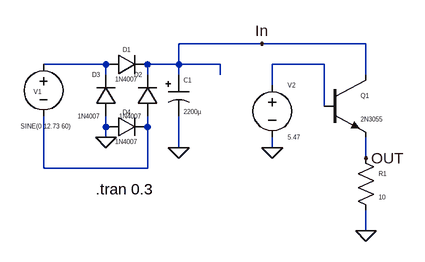
[diagram p0: schematic V1_front_end.asc]
V1_front_end.asc, the LTspice schematic file:
Version 4.1
SHEET 1 880 680
WIRE 384 80 256 80
WIRE 544 80 384 80
WIRE 144 112 48 112
WIRE 256 112 256 80
WIRE 256 112 208 112
WIRE 320 112 256 112
WIRE 480 112 400 112
WIRE 144 128 144 112
WIRE 208 128 208 112
WIRE 256 128 256 112
WIRE 320 128 320 112
WIRE 544 128 544 80
WIRE 400 144 400 112
WIRE 480 176 480 112
WIRE 144 208 144 192
WIRE 208 208 208 192
WIRE 144 224 144 208
WIRE 256 240 256 192
WIRE 400 240 400 224
WIRE 544 256 544 224
WIRE 48 272 48 192
WIRE 208 272 208 208
WIRE 208 272 48 272
WIRE 544 368 544 336
FLAG 144 224 0
FLAG 256 240 0
FLAG 400 240 0
FLAG 544 368 0
FLAG 544 256 OUT
FLAG 384 80 In
SYMBOL voltage 48 96 R0
WINDOW 0 -15 58 Left 0
WINDOW 3 -35 111 Left 0
WINDOW 123 0 0 Left 0
WINDOW 39 0 0 Left 0
SYMATTR InstName V1
SYMATTR Value SINE(0 12.73 60)
SYMBOL diode 144 128 R270
WINDOW 0 32 32 VTop 0
WINDOW 3 0 32 VBottom 0
SYMATTR InstName D1
SYMATTR Value 1N4007
SYMBOL diode 160 192 R180
WINDOW 0 24 64 Left 0
WINDOW 3 24 0 Left 0
SYMATTR InstName D3
SYMATTR Value 1N4007
SYMBOL diode 224 192 R180
WINDOW 0 24 64 Left 0
WINDOW 3 24 0 Left 0
SYMATTR InstName D2
SYMATTR Value 1N4007
SYMBOL diode 144 224 R270
WINDOW 0 32 32 VTop 0
WINDOW 3 0 32 VBottom 0
SYMATTR InstName D4
SYMATTR Value 1N4007
SYMBOL polcap 240 128 R0
WINDOW 0 24 8 Left 0
WINDOW 3 24 57 Left 0
SYMATTR InstName C1
SYMATTR Value 2200µ
SYMBOL npn 480 128 R0
WINDOW 0 56 32 Left 0
WINDOW 3 56 68 Left 0
SYMATTR InstName Q1
SYMATTR Value 2N3055
SYMBOL voltage 400 128 R0
WINDOW 0 24 16 Left 0
WINDOW 3 24 96 Left 0
SYMATTR InstName V2
SYMATTR Value 5.47
SYMBOL res 528 240 R0
WINDOW 0 36 40 Left 0
WINDOW 3 36 76 Left 0
SYMATTR InstName R1
SYMATTR Value 10
TEXT 128 304 Left 2 !.tran 0.3

The netlist it stands for:
* V1_front_end.asc
V1 N001 N003 SINE(0 12.73 60)
D1 N001 In 1N4007
D3 0 N001 1N4007
D2 N003 In 1N4007
D4 0 N003 1N4007
C1 In 0 2200µ
Q1 In N002 OUT 0 2N3055
V2 N002 0 5.47
R1 OUT 0 10
.model D D
.lib standard.dio
.model NPN NPN
.model PNP PNP
.lib standard.bjt
.tran 0.3
.backanno
.end